# Altium schematic sheet 24V_Sheet.SchDoc (part 1 of 3)
size 420 x 297 mm; SheetNumber: 3; SheetTotal: 4
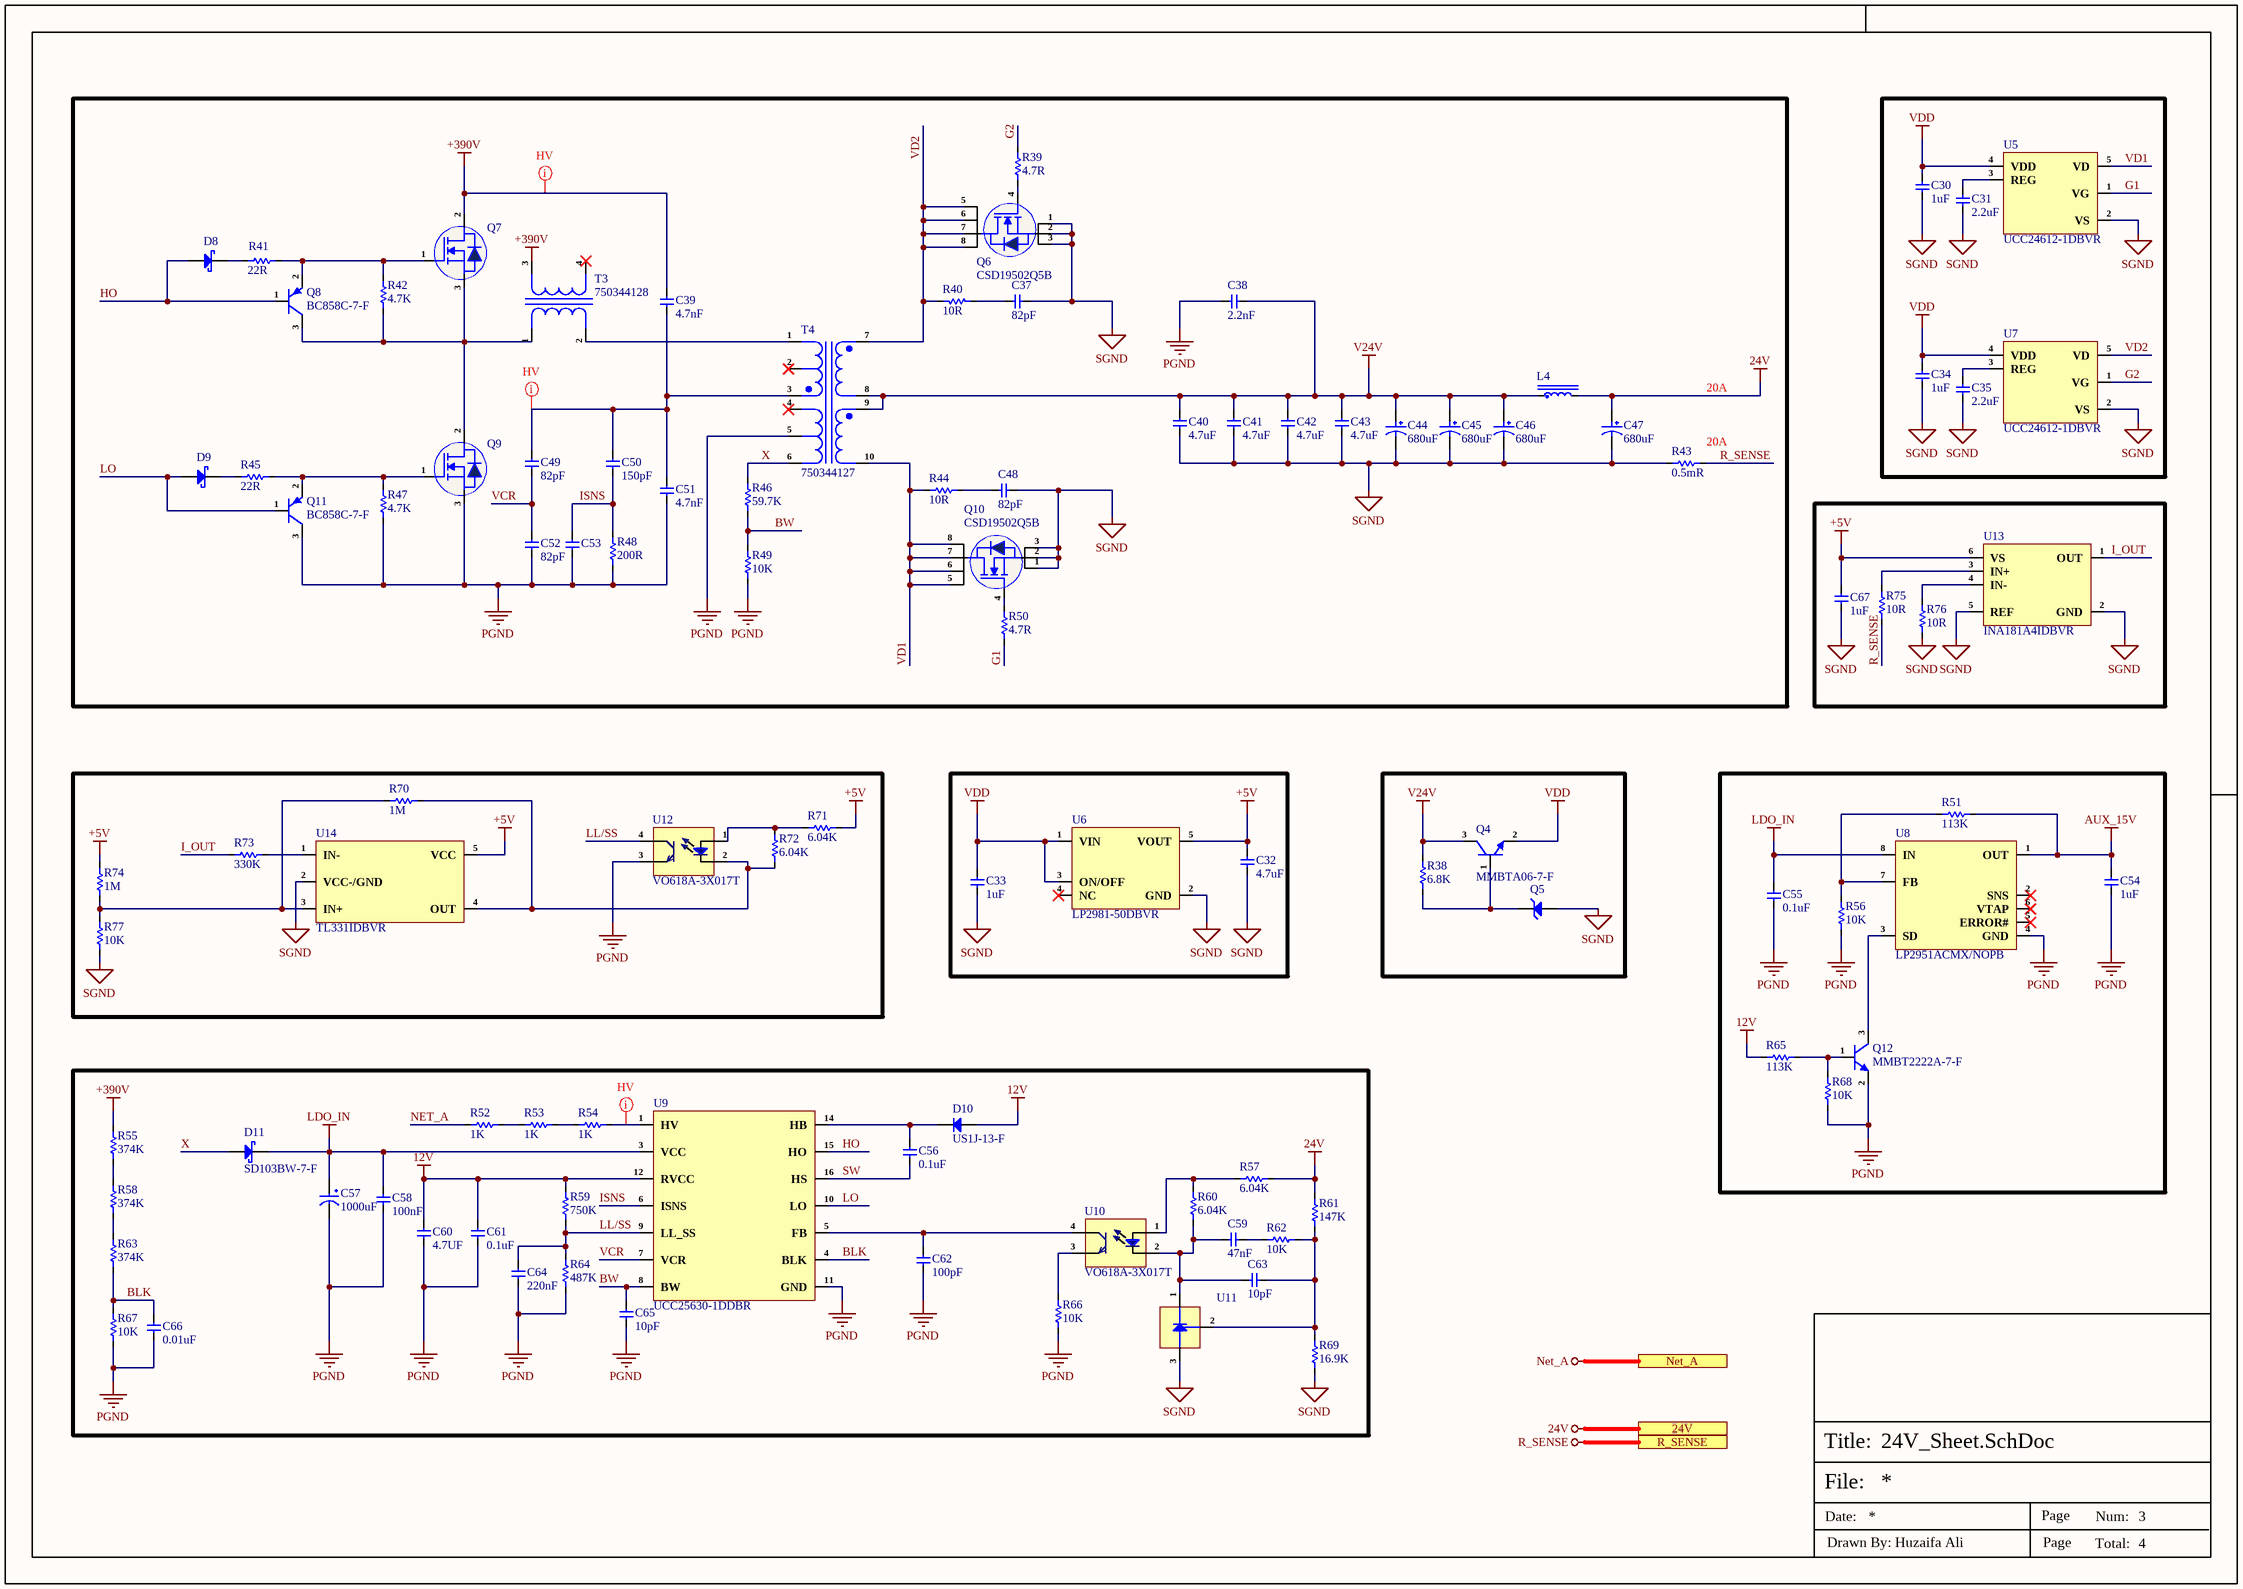
[diagram p0: 24V_Sheet.SchDoc]

## Parts
C30  1uF  [Cap-0603]
C31  2.2uF  [Cap-0603]
C32  4.7uF  [Cap-0603]
C33  1uF  [Cap-0603]
C34  1uF  [Cap-0603]
C35  2.2uF  [Cap-0603]
C37  82pF  [Cap-1206]
C38  2.2nF  [KJKF222M2FF7035A075E]
C39  4.7nF  [MMK472J3AC2KN206G0]
C40  4.7uF  [Cap-1206]
C41  4.7uF  [Cap-1206]
C42  4.7uF  [Cap-1206]
C43  4.7uF  [Cap-1206]
C44  680uF  [ERS1HM681W20OT]
C45  680uF  [ERS1HM681W20OT]
C46  680uF  [ERS1HM681W20OT]
C47  680uF  [ERS1HM681W20OT]
C48  82pF  [Cap-1206]
C49  82pF  [Cap-1206]
C50  150pF  [Cap-1206]
C51  4.7nF  [MMK472J3AC2KN206G0]
C52  82pF  [Cap-1206]
C53  RF15N3R3C500CT  [Cap-0402]  (value not drawn)
C54  1uF  [Cap-0603]
C55  0.1uF  [Cap-1206]
C56  0.1uF  [Cap-0805]
C57  1000uF  [VZH102M1HTR-1616]
C58  100nF  [Cap-0603]
C59  47nF  [Cap-0402]
C60  4.7UF  [Cap-0603]
C61  0.1uF  [Cap-0805]
C62  100pF  [Cap-0603]
C63  10pF  [Cap-0603]
C64  220nF  [Cap-1206]
C65  10pF  [Cap-0603]
C66  0.01uF  [Cap-0805]
C67  1uF  [Cap-0603]
D8  SD103BW-7-F  [SOD-123]  (value not drawn)
D9  SD103BW-7-F  [SOD-123]  (value not drawn)
D10  US1J-13-F  [SMA]
D11  SD103BW-7-F  [SOD-123]
L4  PA2607.301NLT  [PA2607.301NLT]  (value not drawn)
Q4  MMBTA06-7-F  [SOT-23]
Q5  BZX384-C15,115  [SOD-323]  (value not drawn)
Q6  CSD19502Q5B  [8-VSONP (5x6)]
Q7  IPA60R120P7XKSA1  [TO-220-3]  (value not drawn)
Q8  BC858C-7-F  [SOT-23]
Q9  IPA60R120P7XKSA1  [TO-220-3]  (value not drawn)
Q10  CSD19502Q5B  [8-VSONP (5x6)]
Q11  BC858C-7-F  [SOT-23]
Q12  MMBT2222A-7-F  [SOT-23]
R38  6.8K  [Res-0603]
R39  4.7R  [Res-0603]
R40  10R  [RES-0805]
R41  22R  [Res-0603]
R42  4.7K  [Res-0603]
R43  0.5mR  [RES-2512]
R44  10R  [RES-0805]
R45  22R  [Res-0603]
R46  59.7K  [Res-0603]
R47  4.7K  [Res-0603]
R48  200R  [RES-0805]
R49  10K  [Res-0603]
R50  4.7R  [Res-0603]
R51  113K  [Res-0603]
R52  1K  [Res-1206]
R53  1K  [Res-1206]
R54  1K  [Res-1206]
R55  374K  [Res-1206]
R56  10K  [Res-0603]
R57  6.04K  [Res-0402]
R58  374K  [Res-1206]
R59  750K  [Res-0603]
R60  6.04K  [Res-0402]
R61  147K  [Res-0603]
R62  10K  [Res-0603]
R63  374K  [Res-1206]
R64  487K  [Res-0603]
R65  113K  [Res-0603]
R66  10K  [Res-0603]
R67  10K  [Res-0603]
R68  10K  [Res-0603]
R69  16.9K  [Res-0603]
R70  1M  [Res-0402]
R71  6.04K  [Res-0402]
R72  6.04K  [Res-0402]
R73  330K  [Res-0402]
R74  1M  [Res-0402]
R75  10R  [RES-0805]
R76  10R  [RES-0805]
R77  10K  [Res-0603]
T3  750344128
T4  750344127
U5  UCC24612-1DBVR  [SOT-23-5]
U6  LP2981-50DBVR  [SOT-23-5]
U7  UCC24612-1DBVR  [SOT-23-5]
U8  LP2951ACMX/NOPB  [SOIC-8]
U9  UCC25630-1DDBR  [UCC25630-1DDBR]
U10  VO618A-3X017T  [4-SMD  (SFH617A-1X007T)]
U11  TL431ACDBZR  [SOT-23]  (value not drawn)
U12  VO618A-3X017T  [4-SMD  (SFH617A-1X007T)]
U13  INA181A4IDBVR  [SOT-23-6]
U14  TL331IDBVR  [SOT-23-5]

## Ports
24V (see Top_Sheet[3B], Connector_Sheet[5D]), Net_A (see Top_Sheet[4B], Power_Sheet[5D]), R_SENSE (see Top_Sheet[3B], Connector_Sheet[5D])

## Nets
12V: C60.2 C61.2 D10.2(A) R59.2 R65.1 U9.12(RVCC)
24V: C47.1 L4.2 R57.1 R61.2 ; port 24V
+5V: C32.2 C67.2 R71.1 R74.2 U6.5(VOUT) U13.6(VS) U14.5(VCC)
+390V: C39.2 Q7.2(D) R55.2 T3.3
AUX_15V: C54.2 R51.2 U8.1(OUT)
LDO_IN: C55.2 C57.1 C58.2 D11.2(K) U8.8(IN) U9.3(VCC)
NET_A: R52.1 ; port Net_A
PGND: C38.2 C51.1 C52.1 C53.1 C54.1 C55.1 C57.2 C58.1 C60.1 C61.1 C62.1 C64.1 C65.1 C66.1 Q9.3(S) Q11.3(C) Q12.2(E) R47.1 R48.1 R49.1 R56.1 R64.1 R66.1 R67.1 R68.1 T4.5 U8.4(GND) U9.11(GND) U12.3(E)
R_SENSE: R43.2 R75.1 ; port R_SENSE
SGND: C30.1 C31.1 C32.1 C33.1 C34.1 C35.1 C37.2 C40.1 C41.1 C42.1 C43.1 C44.2 C45.2 C46.2 C47.2 C48.2 C67.1 Q5.2(A) Q6.1(S) Q6.2(S) Q6.3(S) Q10.1(S) Q10.2(S) Q10.3(S) R43.1 R69.1 R76.1 R77.1 U5.2(VS) U6.2(GND) U7.2(VS) U11.3(Anode) U13.2(GND) U13.5(REF) U14.2(VCC-/GND)
V24V: C38.1 C40.2 C41.2 C42.2 C43.2 C44.1 C45.1 C46.1 L4.1 Q4.3(C) R38.2 T4.8 T4.9
VDD: C30.2 C33.2 C34.2 Q4.2(E) U5.4(VDD) U6.1(VIN) U6.3(ON/OFF) U7.4(VDD)
BLK: C66.2 R63.1 R67.2 U9.4(BLK)
BW: C65.2 R46.1 R49.2 U9.8(BW)
G1: R50.1 U5.1(VG)
G2: R39.2 U7.1(VG)
HO: D8.1(A) Q8.1(B) U9.15(HO)
I_OUT: R73.1 U13.1(OUT)
ISNS: C50.1 C53.2 R48.2 U9.6(ISNS)
LL/SS: C64.2 R59.1 R64.2 U9.9(LL_SS) U12.4(C)
LO: D9.1(A) Q11.1(B) U9.10(LO)
SW: C56.1 U9.16(HS)
VCR: C49.1 C52.2 U9.7(VCR)
VD1: Q10.5(D) Q10.6(D) Q10.7(D) Q10.8(D) R44.1 T4.10 U5.5(VD)
VD2: Q6.5(D) Q6.6(D) Q6.7(D) Q6.8(D) R40.1 T4.7 U7.5(VD)
X: D11.1(A) R46.2 T4.6
NetC31_2: C31.2 U5.3(REG)
NetC35_2: C35.2 U7.3(REG)
NetC37_1: C37.1 R40.2
NetC39_1: C39.1 C49.2 C50.2 C51.2 T4.3
NetC48_1: C48.1 R44.2
NetC56_2: C56.2 D10.1(K) U9.14(HB)
NetC59_1: C59.1 C63.2 R60.1 U10.2(Ca) U11.1(Cathode)
NetC59_2: C59.2 R62.2
NetC62_2: C62.2 U9.5(FB) U10.4(C)
NetC63_1: C63.1 R61.1 R62.1 R69.2 U11.2(REF)
NetD8_2: D8.2(K) R41.1
NetD9_2: D9.2(K) R45.1
NetQ4_1: Q4.1(B) Q5.1(K) R38.1
NetQ6_4: Q6.4(G) R39.1
NetQ7_1: Q7.1(G) Q8.2(E) R41.2 R42.2
NetQ7_3: Q7.3(S) Q8.3(C) Q9.2(D) R42.1 T3.1
NetQ9_1: Q9.1(G) Q11.2(E) R45.2 R47.2
NetQ10_4: Q10.4(G) R50.2
NetQ12_1: Q12.1(B) R65.2 R68.2
NetQ12_3: Q12.3(C) U8.3(SD)
NetR51_1: R51.1 R56.2 U8.7(FB)
NetR52_2: R52.2 R53.1
NetR53_2: R53.2 R54.1
NetR54_2: R54.2 U9.1(HV)
NetR55_1: R55.1 R58.2
NetR57_2: R57.2 R60.2 U10.1(An)
NetR58_1: R58.1 R63.2
NetR66_2: R66.2 U10.3(E)
NetR70_1: R70.1 R74.1 R77.2 U14.3(IN+)
NetR70_2: R70.2 R72.1 U12.2(Ca) U14.4(OUT)
NetR71_2: R71.2 R72.2 U12.1(An)
NetR73_2: R73.2 U14.1(IN-)
NetR75_2: R75.2 U13.3(IN+)
NetR76_2: R76.2 U13.4(IN-)
NetT3_2: T3.2 T4.1

Not connected (* = marked no-connect by the designer): T3 4*; T4 2* 4*; U6 4(NC)*; U8 2(SNS)* 5(ERROR#)* 6(VTAP)*

## Layout directives
mark named HV: +390V, NetC39_1, NetR54_2

## Notes on the sheet
- 20A
- (near R43) 20A
- File:
- Title:
- Date:
- Page
- Num:
- Total:
- Drawn By: Huzaifa Ali